# EAGLE design Board (EAGLE 9.0.1)
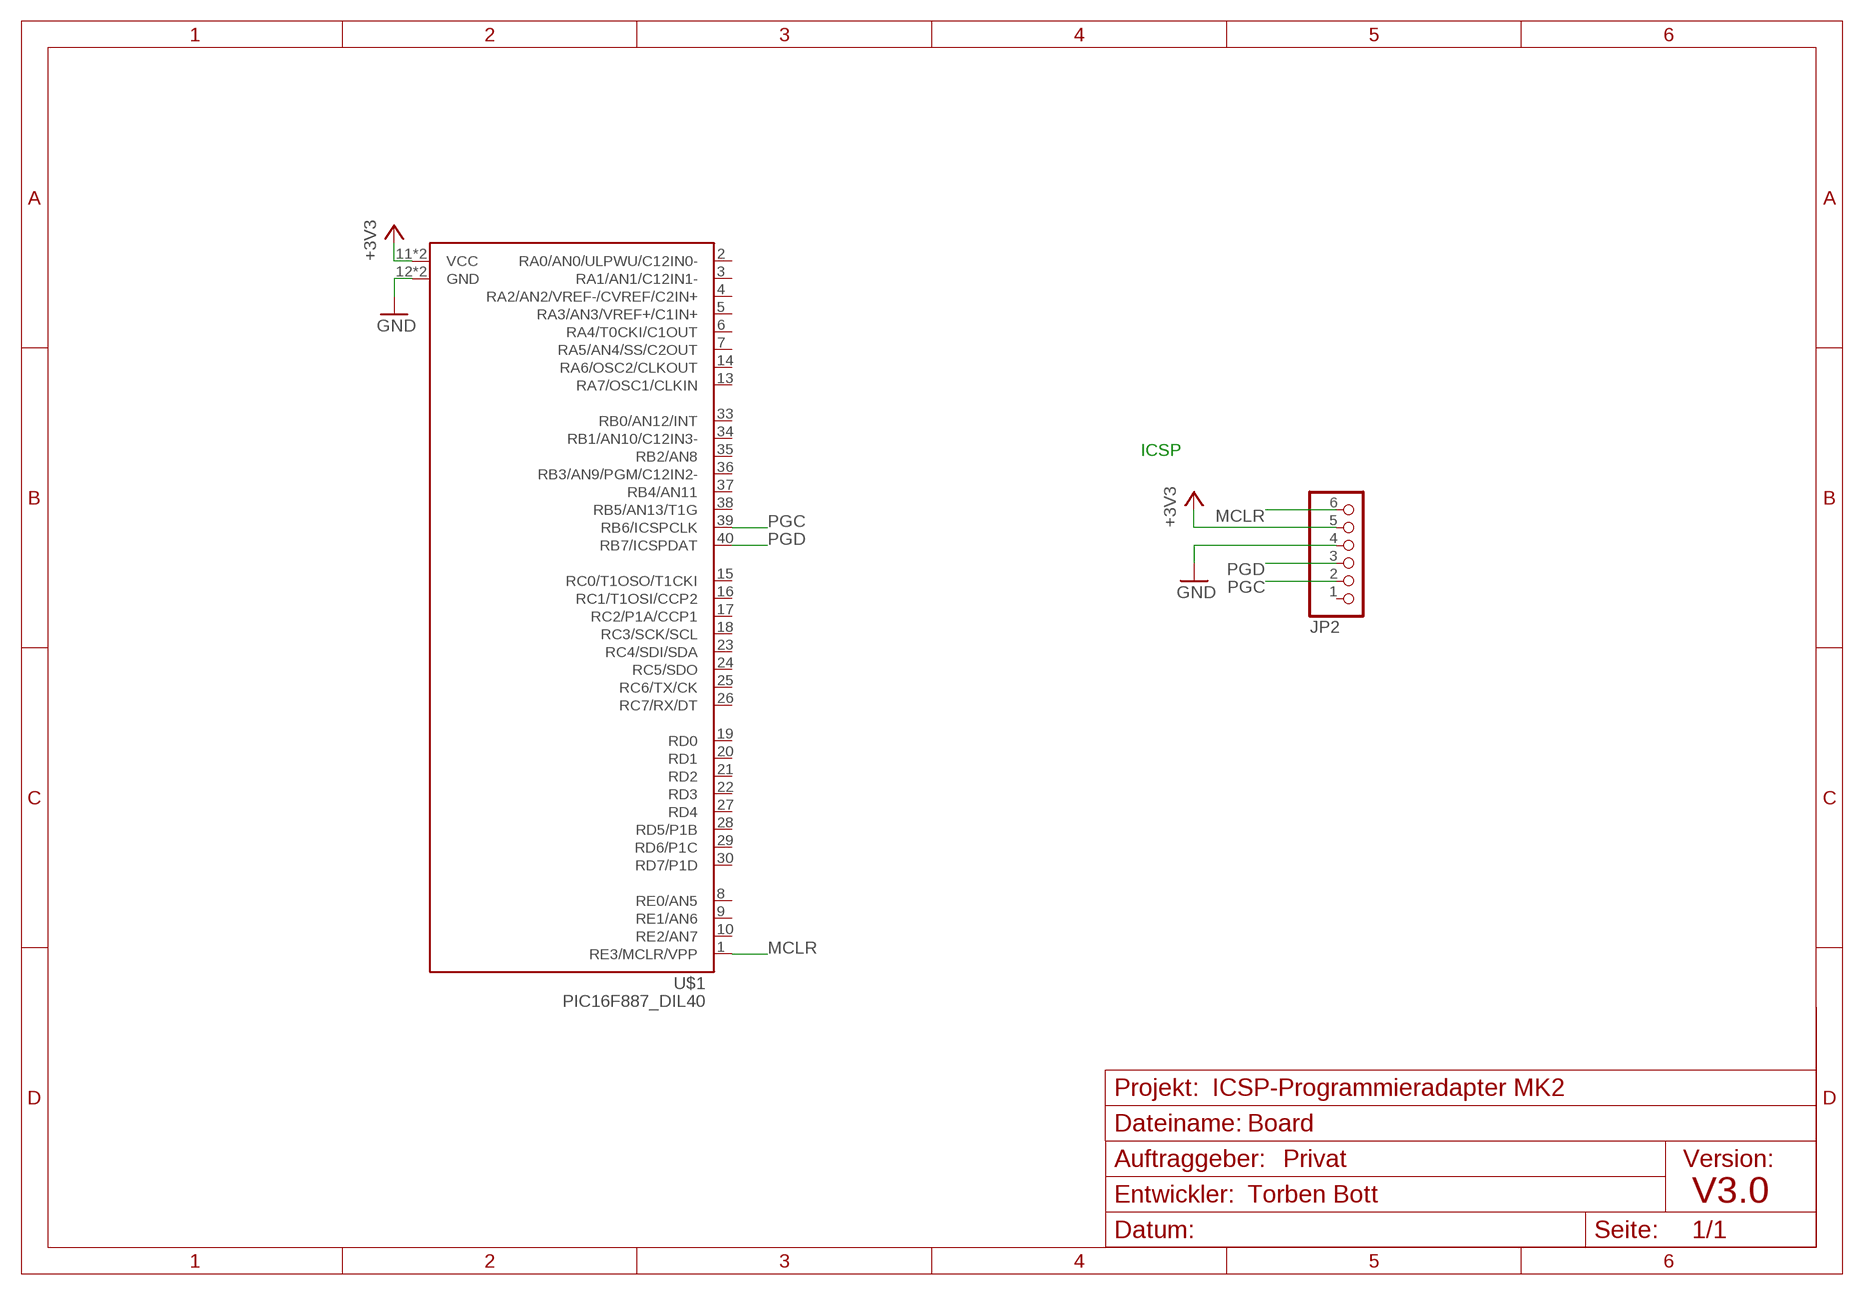
[diagram p0: schematic, sheet 1]

## Parts
JP2  PINHD-1X6/90  [1X06/90]
U$1  PIC16F887_DIL40  [DIL40]

## Nets
+3V3: JP2.5 U$1.11(VCC) U$1.32(VCC)
GND: JP2.4 U$1.12(GND) U$1.31(GND)
MCLR: JP2.6 U$1.1(RE3/MCLR/VPP)
PGC: JP2.2 U$1.39(RB6/ICSPCLK)
PGD: JP2.3 U$1.40(RB7/ICSPDAT)
Unconnected: JP2.1 U$1.2(RA0/AN0/ULPWU/C12IN0-) U$1.3(RA1/AN1/C12IN1-) U$1.4(RA2/AN2/VREF-/CVREF/C2IN+) U$1.5(RA3/AN3/VREF+/C1IN+) U$1.6(RA4/T0CKI/C1OUT) U$1.7(RA5/AN4/SS/C2OUT) U$1.8(RE0/AN5) U$1.9(RE1/AN6) U$1.10(RE2/AN7) U$1.13(RA7/OSC1/CLKIN) U$1.14(RA6/OSC2/CLKOUT) U$1.15(RC0/T1OSO/T1CKI) U$1.16(RC1/T1OSI/CCP2) U$1.17(RC2/P1A/CCP1) U$1.18(RC3/SCK/SCL) U$1.19(RD0) U$1.20(RD1) U$1.21(RD2) U$1.22(RD3) U$1.23(RC4/SDI/SDA) U$1.24(RC5/SDO) U$1.25(RC6/TX/CK) U$1.26(RC7/RX/DT) U$1.27(RD4) U$1.28(RD5/P1B) U$1.29(RD6/P1C) U$1.30(RD7/P1D) U$1.33(RB0/AN12/INT) U$1.34(RB1/AN10/C12IN3-) U$1.35(RB2/AN8) U$1.36(RB3/AN9/PGM/C12IN2-) U$1.37(RB4/AN11) U$1.38(RB5/AN13/T1G)

## Notes on the sheet
- ICSP
- ICSP-Programmieradapter MK2
- Privat
- Torben Bott | V3.0

## Library data of the parts
JP2 = pinhead:PINHD-1X6: PIN HEADER
U$1 = Eigene Library:PIC16F887_DIL40: Farnell: 143-9541

## Board
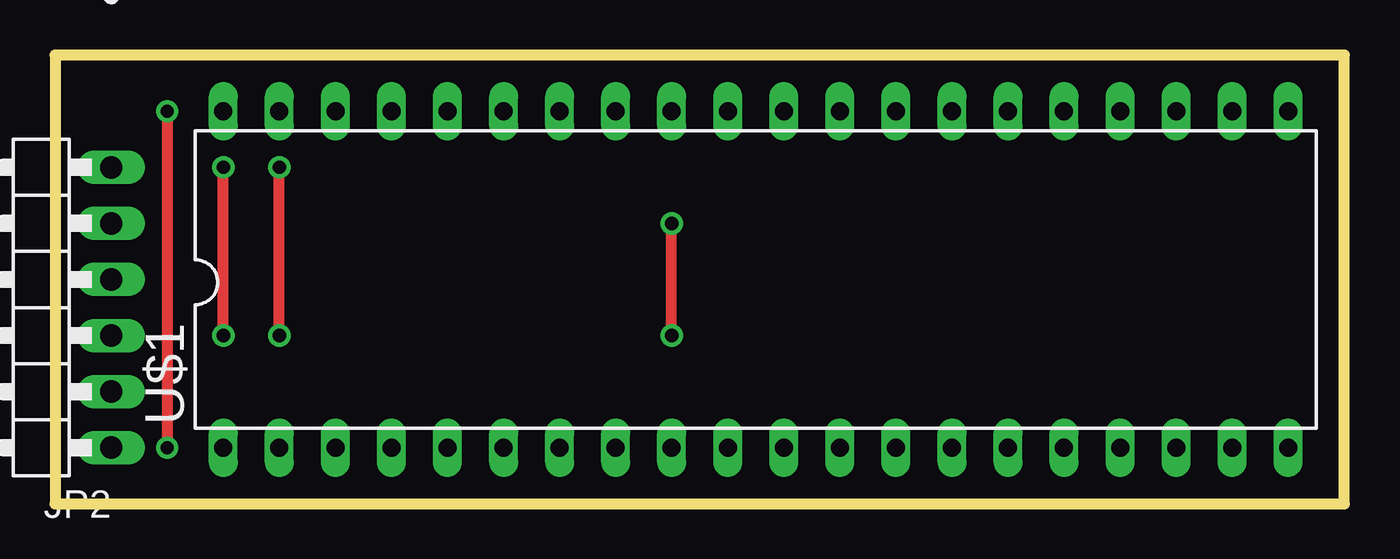
[diagram p1: board, top side]
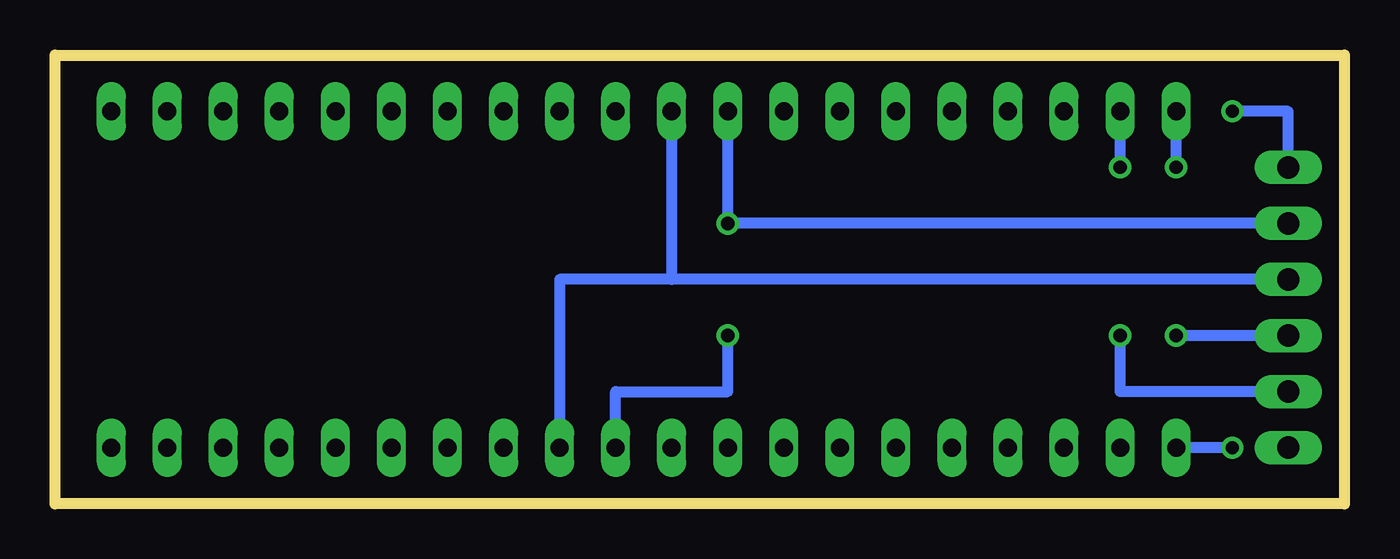
[diagram p2: board, bottom side, seen from below]

Size 58.42 x 20.32 mm. Coordinates in mm from the lower left corner, seen from the top.
Outline: 0,20.32 0,0 58.42,0 58.42,20.32 0,20.32
Copper layers (1*16): Top 0.035mm / dielectric 1.5mm / Bottom 0.035mm
Design rules "default": minimum track width 6mil, minimum drill 0.35mm, track to track 6mil, track to pad 6mil, pad to pad 6mil, via to via 6mil, smd to smd 6mil, copper to edge 40mil, drill to drill 6mil, minimum pad ring 10mil, minimum via ring 8mil, stop-mask expansion 4mil, vias tented up to drill 0mil, thermal gap 10mil

### Footprints (pad centres in the part's own frame; a part is rotated, then mirrored left to right if it is on the bottom)
1X06/90 = drill 1.016 long: 1 -6.35,-3.81; 2 -3.81,-3.81; 3 -1.27,-3.81; 4 1.27,-3.81; 5 3.81,-3.81; 6 6.35,-3.81
DIL40 = drill 0.813 long: 1 -24.13,-7.62; 2 -21.59,-7.62; 3 -19.05,-7.62; 4 -16.51,-7.62; 5 -13.97,-7.62; 6 -11.43,-7.62; 7 -8.89,-7.62; 8 -6.35,-7.62; 9 -3.81,-7.62; 10 -1.27,-7.62; 11 1.27,-7.62; 12 3.81,-7.62; 13 6.35,-7.62; 14 8.89,-7.62; 15 11.43,-7.62; 16 13.97,-7.62; 17 16.51,-7.62; 18 19.05,-7.62; 19 21.59,-7.62; 20 24.13,-7.62; 21 24.13,7.62; 22 21.59,7.62; 23 19.05,7.62; 24 16.51,7.62; 25 13.97,7.62; 26 11.43,7.62; 27 8.89,7.62; 28 6.35,7.62; 29 3.81,7.62; 30 1.27,7.62; 31 -1.27,7.62; 32 -3.81,7.62; 33 -6.35,7.62; 34 -8.89,7.62; 35 -11.43,7.62; 36 -13.97,7.62; 37 -16.51,7.62; 38 -19.05,7.62; 39 -21.59,7.62; 40 -24.13,7.62

### Placement (x,y rotation side)
JP2  -1.27,8.89 90 top
U$1  31.75,10.16 0 top

### Tracks (layer width: path | path; a pad name or v marks a point on that pad's centre or on a via)
+3V3  (via drill 0.6)
  Top 0.508: v27.94,7.62 v27.94,12.7
  Bottom 0.508: JP2.5 v27.94,12.7 U$1.32 | U$1.11 33.02,5.08 27.94,5.08 v27.94,7.62
GND
  Bottom 0.508: JP2.4 30.48,10.16 | 30.48,10.16 35.56,10.16 U$1.12 | U$1.31 30.48,10.16
MCLR  (via drill 0.6)
  Top 0.508: v5.08,17.78 v5.08,2.54
  Bottom 0.508: JP2.6 2.54,17.78 v5.08,17.78 | v5.08,2.54 U$1.1
PGC  (via drill 0.6)
  Top 0.508: v10.16,7.62 v10.16,15.24
  Bottom 0.508: JP2.2 10.16,5.08 v10.16,7.62 | v10.16,15.24 U$1.39
PGD  (via drill 0.6)
  Top 0.508: v7.62,7.62 v7.62,15.24
  Bottom 0.508: JP2.3 v7.62,7.62 | v7.62,15.24 U$1.40